# Altium project SLD-1550-ANR.PrjPCB
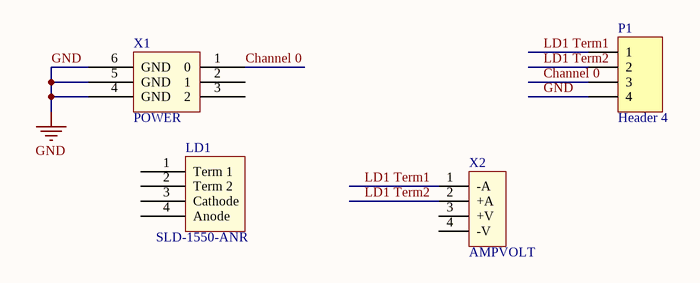
[diagram p0: SLD-1550-ANR.SchDoc]
1 sheet, 4 parts. Net scope: global (net labels, ports and power ports of the same name join across sheets).
Board file: SLD-1550-ANR.PcbDoc

## Sheet SLD-1550-ANR.SchDoc
size A3; Address1: Address1; Address2: Address2; Address3: Address3; Address4: Address4; DocumentNumber: АБВГ.123456.001 Э3; SheetNumber: 1; Scale: 1:1; DocumentType: Схема электрическая принципиальная; FirstReferrence: АБВГ.123456.001

### Parts
LD1  SLD-1550-ANR  [СЛД-1550-АНР]
P1  Header 4  [HDR1X4]
X1  POWER  [POWER]
X2  AMPVOLT  [AMP_VOLTMETER]

### Nets
GND: P1.4 X1.4(GND) X1.5(GND) X1.6(GND)
Channel 0: P1.3 X1.1(0)
LD1 Term1: P1.1 X2.1(-A)
LD1 Term2: P1.2 X2.2(+A)

Not connected (* = marked no-connect by the designer): LD1 1(Term_1) 2(Term_2) 3(Cathode) 4(Anode); X1 2(1) 3(2); X2 3(+V) 4(-V)

### Notes on the sheet
- Title
- Size:
- Date:
- A3
- Number:
- Time:
- Revision:
- Sheet
- of
- File:

### Library data of the parts
P1 = Header 4: Header, 4-Pin; LatestRevisionDate: 17-Jul-2002; LatestRevisionNote: Re-released for DXP Platform.; Publisher: Altium Limited
X2 = AMP_VOLTMETER